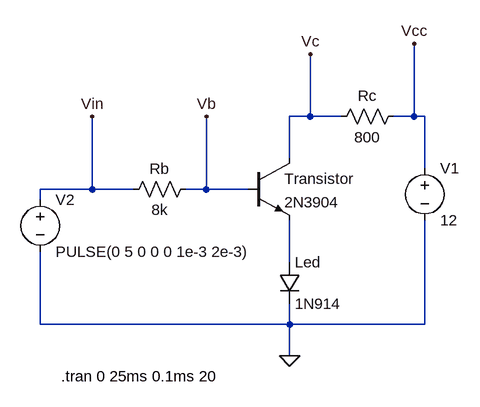
[diagram p0: schematic LED15mA.asc]
LED15mA.asc, the LTspice schematic file:
Version 4
SHEET 1 880 680
WIRE 128 64 128 -32
WIRE 128 64 96 64
WIRE 176 64 128 64
WIRE 288 64 288 -48
WIRE 288 64 256 64
WIRE 304 64 288 64
WIRE 96 128 96 64
WIRE 304 144 304 64
WIRE -208 176 -208 64
WIRE -208 176 -288 176
WIRE -144 176 -208 176
WIRE -32 176 -32 64
WIRE -32 176 -64 176
WIRE 32 176 -32 176
WIRE -288 192 -288 176
WIRE 96 288 96 224
WIRE -288 384 -288 272
WIRE 96 384 96 352
WIRE 96 384 -288 384
WIRE 304 384 304 224
WIRE 304 384 96 384
WIRE 96 432 96 384
FLAG 96 432 0
FLAG -32 64 Vb
FLAG 288 -48 Vcc
FLAG 128 -32 Vc
FLAG -208 64 Vin
SYMBOL voltage 304 128 R0
WINDOW 123 0 0 Left 0
WINDOW 39 0 0 Left 0
SYMATTR InstName V1
SYMATTR Value 12
SYMBOL res 272 48 R90
WINDOW 0 0 56 VBottom 2
WINDOW 3 32 56 VTop 2
SYMATTR InstName Rc
SYMATTR Value 800
SYMBOL npn 32 128 R0
SYMATTR InstName Transistor
SYMATTR Value 2N3904
SYMBOL res -48 160 R90
WINDOW 0 0 56 VBottom 2
WINDOW 3 32 56 VTop 2
SYMATTR InstName Rb
SYMATTR Value 8k
SYMBOL diode 80 288 R0
SYMATTR InstName Led
SYMATTR Value 1N914
SYMATTR Description Light Emitting Diode
SYMATTR Type led
SYMBOL voltage -288 176 R0
WINDOW 123 0 0 Left 0
WINDOW 39 0 0 Left 0
SYMATTR InstName V2
SYMATTR Value PULSE(0 5 0 0 0 1e-3 2e-3)
TEXT -256 464 Left 2 !.tran 0 25ms 0.1ms 20

The netlist it stands for:
* LED15mA.asc
V1 Vcc 0 12
Rc Vcc Vc 800
Q§Transistor Vc Vb N001 0 2N3904
Rb Vb Vin 8k
D§Led N001 0 1N914
V2 Vin 0 PULSE(0 5 0 0 0 1e-3 2e-3)
.model D D
.lib standard.dio
.model NPN NPN
.model PNP PNP
.lib standard.bjt
.tran 0 25ms 0.1ms 20
.backanno
.end